# Altium project RFSOC_SAWG_Mezzanine.PrjPcb
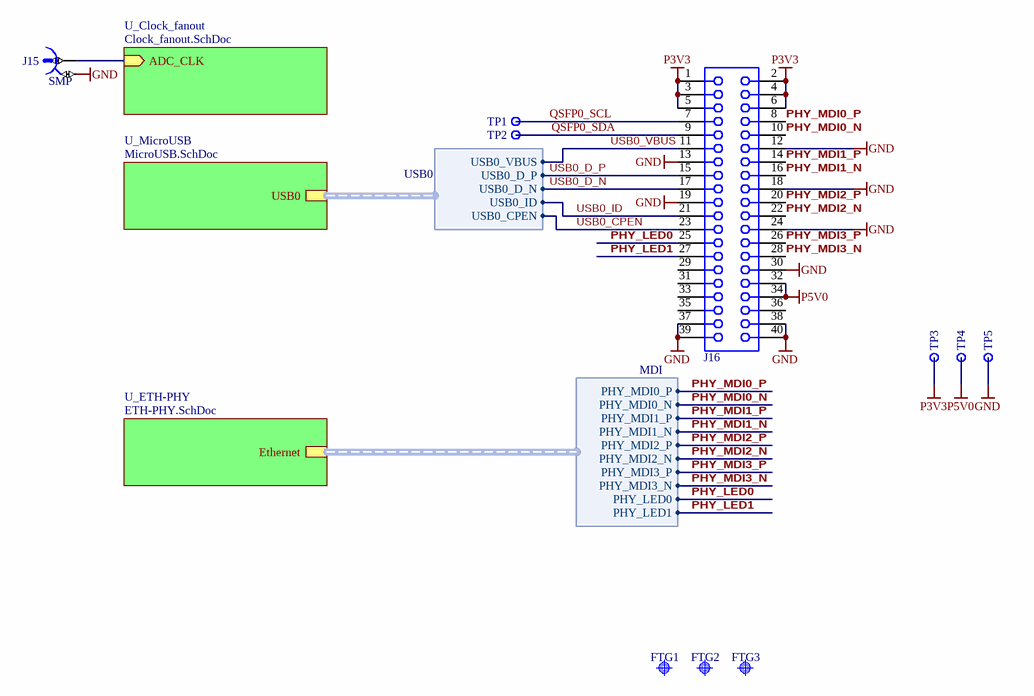
[diagram p0: RFSOC_SAWG_Mezzanine.SchDoc]
4 sheets, 92 parts. Net scope: hierarchical (ports join the sheet entries above them; power ports are global).
Board file: RFSOC_SAWG_Mezzanine.PcbDoc
Sheets:
  RFSOC_SAWG_Mezzanine.SchDoc
    U_Clock_fanout = Clock_fanout.SchDoc
    U_ETH-PHY = ETH-PHY.SchDoc
    U_MicroUSB = MicroUSB.SchDoc

## Sheet RFSOC_SAWG_Mezzanine.SchDoc: RFSOC SAWG
size 420 x 297 mm; Author: G.Kasprowicz; CompanyName: WUT ISE; DrawnBy: G.Kasprowicz; Organization: WUT ISE; Address1: PW ISE; Address2: Nowowiejska 15/19 00-665 Warsaw; Address3: gkasprow@gmail.com; Revision: 1; SheetNumber: 1; SheetTotal: 4; ModifiedBy: -; CheckedDate: -; Title2: Mezzanine; DivGrp: WUT ISE; Designer: G.Kasprowicz; ModifiedDate: -; ProjectName: Sensor Box

### Parts
FTG1  Use only in PCB  [FIDUCIAL_TOP_S100-200]  (value not drawn)
FTG2  Use only in PCB  [FIDUCIAL_TOP_S100-200]  (value not drawn)
FTG3  Use only in PCB  [FIDUCIAL_TOP_S100-200]  (value not drawn)
J15  SMP  [AMPHENOL_302102]
J16  658807713040  [658807713040]  (value not drawn)
TP1  Test Point  [TPS127]  (value not drawn)  (no BOM)
TP2  Test Point  [TPS127]  (value not drawn)  (no BOM)
TP3  Test Point  [TPS127]  (value not drawn)
TP4  Test Point  [TPS127]  (value not drawn)
TP5  Test Point  [TPS127]  (value not drawn)

### Sub-sheets
U_Clock_fanout = Clock_fanout.SchDoc: ADC_CLK (in)
U_ETH-PHY = ETH-PHY.SchDoc: Ethernet (harness MDI)
U_MicroUSB = MicroUSB.SchDoc: USB0 (harness USB0)

### Harnesses
USB0: USB0_VBUS, USB0_D_P, USB0_D_N, USB0_ID, USB0_CPEN
MDI: PHY_MDI0_N, PHY_MDI1_P, PHY_MDI1_N, PHY_MDI2_P, PHY_MDI2_N, PHY_MDI3_P, PHY_MDI3_N, PHY_LED0, PHY_LED1, PHY_MDI0_P

### Nets
GND: J15.2 J16.12 J16.13 J16.18 J16.19 J16.24 J16.30 J16.37 J16.38 J16.39 J16.40 TP5.1
P3V3: J16.1 J16.2 J16.3 J16.4 J16.5 J16.6 TP3.1
P5V0: J16.32 J16.34 TP4.1
PHY_LED0: J16.25 ; sheet U_ETH-PHY/Ethernet.PHY_LED0
PHY_LED1: J16.27 ; sheet U_ETH-PHY/Ethernet.PHY_LED1
PHY_MDI0_N: J16.10 ; sheet U_ETH-PHY/Ethernet.PHY_MDI0_N
PHY_MDI0_P: J16.8 ; sheet U_ETH-PHY/Ethernet.PHY_MDI0_P
PHY_MDI1_N: J16.16 ; sheet U_ETH-PHY/Ethernet.PHY_MDI1_N
PHY_MDI1_P: J16.14 ; sheet U_ETH-PHY/Ethernet.PHY_MDI1_P
PHY_MDI2_N: J16.22 ; sheet U_ETH-PHY/Ethernet.PHY_MDI2_N
PHY_MDI2_P: J16.20 ; sheet U_ETH-PHY/Ethernet.PHY_MDI2_P
PHY_MDI3_N: J16.28 ; sheet U_ETH-PHY/Ethernet.PHY_MDI3_N
PHY_MDI3_P: J16.26 ; sheet U_ETH-PHY/Ethernet.PHY_MDI3_P
QSFP0_SCL: J16.7 TP1.1
QSFP0_SDA: J16.9 TP2.1
USB0_CPEN: J16.23 ; sheet U_MicroUSB/USB0.USB0_CPEN
USB0_D_N: J16.17 ; sheet U_MicroUSB/USB0.USB0_D_N
USB0_D_P: J16.15 ; sheet U_MicroUSB/USB0.USB0_D_P
USB0_ID: J16.21 ; sheet U_MicroUSB/USB0.USB0_ID
USB0_VBUS: J16.11 ; sheet U_MicroUSB/USB0.USB0_VBUS
NetJ15_1: J15.1 ; sheet U_Clock_fanout/ADC_CLK

Not connected (* = marked no-connect by the designer): J16 29 31 33 35 36

### Notes on the sheet
- Project/Equipment
- Document
- Designer
- Drawn by
- Check.by
- Copyright WUT ISE 2020.
  This documentation describes Open Hardware and is licensed under the CERN OHL v.1.2. You may redistribute and modify this documentation under the terms of the CERN OHL v.1.2. (http://ohwr.org/CERNOHL). This documentation is distributed WITHOUT ANY EXPRESS OR IMPLIED WARRANTY, INCLUDING OF MERCHANTABILITY, SATISFACTORY QUALITY AND FITNESS FOR A PARTICULAR PURPOSE. Please see the CERN OHL v.1.2 for applicable conditions.
- Contact
- File
- Last Mod.
- Print Date
- Sheet
- Size
- A3
- of
- Rev

### Library data of the parts
FTG1-FTG3 = FIDUCIAL_TARGET_S100-200: Fiducial Target; Part Description: Square Fiducial Target, Top Layer, 1.0mm, Top Solder 2.0mm, Keepout =2.0mm; Mounted: No; Part Number: FIDUCIAL_TARGET_S100-200; Component Kind: Standard (No BOM); Component Type: Standard (No BOM); Pin Count: 1; Family: Fiducial; Socket: No; SMD: Yes; Sense: No; Status: None; ComponentHeight: 0mm; HelpURL: Undefined; Author: CERN DEM JLC; CreateDate: 09.02.2010; LatestRevisionDate: 04.04.2012; PackageDescription: Square Fiducial Target, Top Layer, 1.0mm, Top Solder 2.0mm, Keepout =2.0mm
J15 = AMPHENOL_302102: Part Description: 50 Ohm RF Connector, SMP End Launch Jack for 1.6mm PCB,  Flat Tab Contact; Manufacturer Part Number: 302102; PressFit: No; Part Number: AMPHENOL_302102; Component Kind: Standard; Component Type: Standard; Pin Count: 2; Family: SMP; Mounted: Yes; Socket: No; SMD: No; Sense: No; Status: None; Manufacturer: AMPHENOL; ComponentHeight: 5.09mm; HelpURL: \\cern.ch\dfs\Applications\Altium\Datasheets\AMPHENOL_302102.pdf; Author: CERN DEM MR; CreateDate: 28.11.2017; LatestRevisionDate: 19.12.2017
J16 = 658807713040: WR-BTB Board to Board Connector, Female Receptacle, pitch 0.8mm, height 7.75mm, 40p; Manufacturer: Wurth Elektronik; Compliance: Lead free / RoHS; Contact Resistance: 50mΩ; Insulation Resistance: 100MΩ; Rated Current: 0.5A; Working Voltage: 50VAC; Withstanding Voltage: 500VAC; ComponentLink1Description: Website Link; ComponentLink1URL: https://www.we-online.com/redexpert/article/658807713040?ad; ComponentLink2Description: Datasheet Link; ComponentLink2URL: https://www.we-online.com/redexpert/spec/658807713040?ad; Manufacturer Part Number: 658807713040; Category: Board-to-Board Connectors; Match Code: WR-BTB; Mount: Surface Mount; Operating Temperature Max: 85°C; Operating Temperature Min: -55°C; Packaging: Tape and Reel; Height: 7.75mm; Gender: Female Receptacle; Number of Pins: 40; Orientation: Vertical; Pitch: 0.8mm
TP1-TP5 = SMD_PAD_1.27X1.27MM: Part Description: 1.27mm x 1.27mm PCB Copper Area (SMD Test Point); Mounted: No; Part Number: SMD_PAD_1.27X1.27MM; Component Type: Standard (No BOM); Pin Count: 1; Family: Test Point; Socket: No; SMD: No; Sense: No; Status: None; ComponentHeight: 0mm; HelpURL: Undefined; Author: CERN DEM JLC; CreateDate: 12.01.2008; LatestRevisionDate: 12.01.2008; PackageDescription: 1.27mm x 1.27mm PCB Copper Area (SMD Test Point)
  TP3-TP5: Component Kind: Standard (No BOM)

## Sheet Clock_fanout.SchDoc: RFSOC SAWG
size 420 x 297 mm; Author: G.Kasprowicz; CompanyName: WUT ISE; DrawnBy: G.Kasprowicz; Organization: WUT ISE; Address1: PW ISE; Address2: Nowowiejska 15/19 00-665 Warsaw; Address3: gkasprow@gmail.com; Revision: 1; SheetNumber: 4; SheetTotal: 4; ModifiedBy: -; CheckedDate: -; Title2: Clock fanout; DivGrp: WUT ISE; Designer: G.Kasprowicz; ModifiedDate: -; ProjectName: Sensor Box
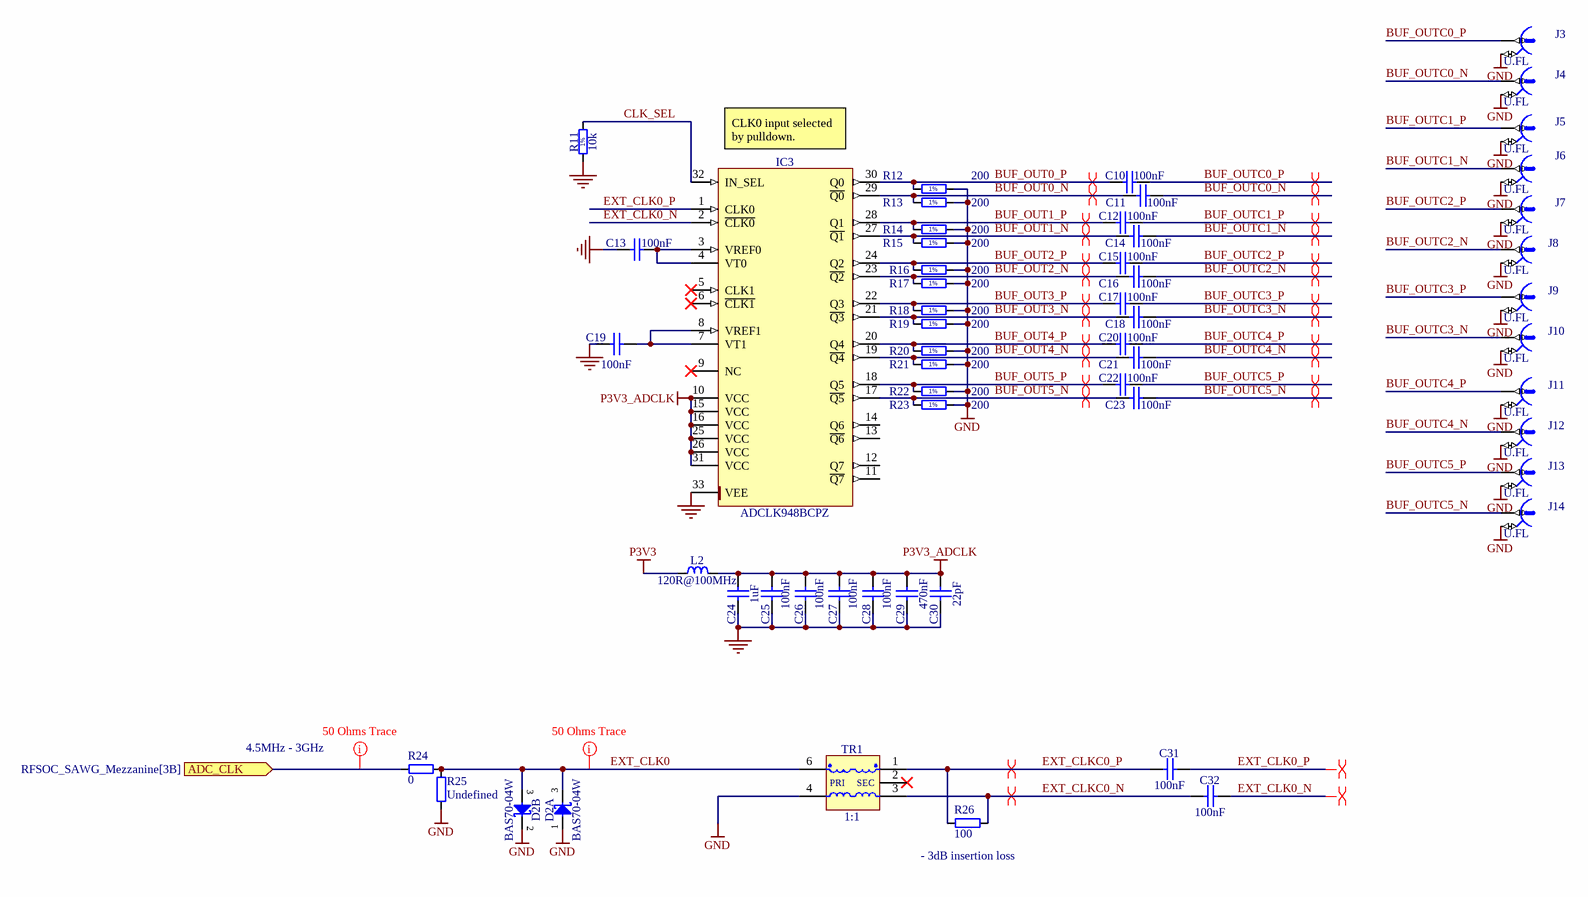
[diagram p1: Clock_fanout.SchDoc]

### Parts
C10  100nF  [CAPC0603X33N]
C11  100nF  [CAPC0603X33N]
C12  100nF  [CAPC0603X33N]
C13  100nF  [CAPC0603X33N]
C14  100nF  [CAPC0603X33N]
C15  100nF  [CAPC0603X33N]
C16  100nF  [CAPC0603X33N]
C17  100nF  [CAPC0603X33N]
C18  100nF  [CAPC0603X33N]
C19  100nF  [CAPC0603X33N]
C20  100nF  [CAPC0603X33N]
C21  100nF  [CAPC0603X33N]
C22  100nF  [CAPC0603X33N]
C23  100nF  [CAPC0603X33N]
C24  1uF  [CAPC1005X55N]
C25  100nF  [CAPC0603X33N]
C26  100nF  [CAPC0603X33N]
C27  100nF  [CAPC0603X33N]
C28  100nF  [CAPC0603X33N]
C29  470nF  [CAPC0603X33N]
C30  22pF  [CAPC1005X55N]
C31  100nF  [CAPC0603X33N]
C32  100nF  [CAPC0603X33N]
D2  BAS70-04W  [SOT65P210X110-3N]  (parts A,B of 2)
IC3  ADCLK948BCPZ  [QFN50P500X500X80-33N-S285]
J3  U.FL  [HIROSE_U.FL-R-SMT-1(10)]
J4  U.FL  [HIROSE_U.FL-R-SMT-1(10)]
J5  U.FL  [HIROSE_U.FL-R-SMT-1(10)]
J6  U.FL  [HIROSE_U.FL-R-SMT-1(10)]
J7  U.FL  [HIROSE_U.FL-R-SMT-1(10)]
J8  U.FL  [HIROSE_U.FL-R-SMT-1(10)]
J9  U.FL  [HIROSE_U.FL-R-SMT-1(10)]
J10  U.FL  [HIROSE_U.FL-R-SMT-1(10)]
J11  U.FL  [HIROSE_U.FL-R-SMT-1(10)]
J12  U.FL  [HIROSE_U.FL-R-SMT-1(10)]
J13  U.FL  [HIROSE_U.FL-R-SMT-1(10)]
J14  U.FL  [HIROSE_U.FL-R-SMT-1(10)]
L2  120R@100MHz  [INDC1608X65N]
R11  10k  [RESC1005X40N]
R12  200  [RESC1005X40N]
R13  200  [RESC1005X40N]
R14  200  [RESC1005X40N]
R15  200  [RESC1005X40N]
R16  200  [RESC1005X40N]
R17  200  [RESC1005X40N]
R18  200  [RESC1005X40N]
R19  200  [RESC1005X40N]
R20  200  [RESC1005X40N]
R21  200  [RESC1005X40N]
R22  200  [RESC1005X40N]
R23  200  [RESC1005X40N]
R24  0  [RESC1005X40N]
R25  Undefined  [RESC1005X40N]
R26  100  [RESC1005X35N]
TR1  1:1  [XFMR_MINI-CIRCUITS_AT224]

### Ports
ADC_CLK (in, see RFSOC_SAWG_Mezzanine[3B])

### Nets
GND: C13.1 C19.1 C24.1 C25.1 C26.1 C27.1 C28.1 C29.1 C30.1 D2.1(A) D2.2(C) IC3.33(VEE) J3.2 J4.2 J5.2 J6.2 J7.2 J8.2 J9.2 J10.2 J11.2 J12.2 J13.2 J14.2 R11.1 R12.2 R13.2 R14.2 R15.2 R16.2 R17.2 R18.2 R19.2 R20.2 R21.2 R22.2 R23.2 R25.2 TR1.4(P)
P3V3: L2.2
P3V3_ADCLK: C24.2 C25.2 C26.2 C27.2 C28.2 C29.2 C30.2 IC3.10(VCC) IC3.15(VCC) IC3.16(VCC) IC3.25(VCC) IC3.26(VCC) IC3.31(VCC) L2.1
BUF_OUT0_N: C11.1 IC3.29(~{Q0}) R13.1
BUF_OUT0_P: C10.1 IC3.30(Q0) R12.1
BUF_OUT1_N: C14.1 IC3.27(~{Q1}) R15.1
BUF_OUT1_P: C12.1 IC3.28(Q1) R14.1
BUF_OUT2_N: C16.1 IC3.23(~{Q2}) R17.1
BUF_OUT2_P: C15.1 IC3.24(Q2) R16.1
BUF_OUT3_N: C18.1 IC3.21(~{Q3}) R19.1
BUF_OUT3_P: C17.1 IC3.22(Q3) R18.1
BUF_OUT4_N: C21.1 IC3.19(~{Q4}) R21.1
BUF_OUT4_P: C20.1 IC3.20(Q4) R20.1
BUF_OUT5_N: C23.1 IC3.17(~{Q5}) R23.1
BUF_OUT5_P: C22.1 IC3.18(Q5) R22.1
BUF_OUTC0_N: C11.2 J4.1
BUF_OUTC0_P: C10.2 J3.1
BUF_OUTC1_N: C14.2 J6.1
BUF_OUTC1_P: C12.2 J5.1
BUF_OUTC2_N: C16.2 J8.1
BUF_OUTC2_P: C15.2 J7.1
BUF_OUTC3_N: C18.2 J10.1
BUF_OUTC3_P: C17.2 J9.1
BUF_OUTC4_N: C21.2 J12.1
BUF_OUTC4_P: C20.2 J11.1
BUF_OUTC5_N: C23.2 J14.1
BUF_OUTC5_P: C22.2 J13.1
CLK_SEL: IC3.32(IN_SEL) R11.2
EXT_CLK0: D2.3(COMAC) R24.2 R25.1 TR1.6(PDOT)
EXT_CLK0_N: C32.2 IC3.2(~{CLK0})
EXT_CLK0_P: C31.2 IC3.1(CLK0)
EXT_CLKC0_N: C32.1 R26.2 TR1.3(S)
EXT_CLKC0_P: C31.1 R26.1 TR1.1(SDOT)
NetC13_2: C13.2 IC3.3(VREF0) IC3.4(VT0)
NetC19_2: C19.2 IC3.7(VT1) IC3.8(VREF1)
NetJ15_1: R24.1 ; port ADC_CLK

Not connected (* = marked no-connect by the designer): IC3 5(CLK1)* 6(~{CLK1})* 9(NC)* 11(~{Q7}) 12(Q7) 13(~{Q6}) 14(Q6); TR1 2(NC)*

### Layout directives
differential pair; differential pair class LVPECL: BUF_OUT0_N, BUF_OUT0_P, BUF_OUT1_N, BUF_OUT1_P, BUF_OUT2_N, BUF_OUT2_P, BUF_OUT3_N, BUF_OUT3_P, BUF_OUT4_N, BUF_OUT4_P, BUF_OUT5_N, BUF_OUT5_P, BUF_OUTC0_N, BUF_OUTC0_P, BUF_OUTC1_N, BUF_OUTC1_P, BUF_OUTC2_N, BUF_OUTC2_P, BUF_OUTC3_N, BUF_OUTC3_P, BUF_OUTC4_N, BUF_OUTC4_P, BUF_OUTC5_N, BUF_OUTC5_P
net class 50 Ohms Trace: EXT_CLK0, NetJ15_1
differential pair; differential pair class Diff_100Ohm: EXT_CLK0_N, EXT_CLK0_P, EXT_CLKC0_N, EXT_CLKC0_P

### Notes on the sheet
- (near IC3) CLK0 input selected by pulldown.
- 4.5MHz - 3GHz
- (near R26) - 3dB insertion loss
- Project/Equipment
- Document
- Designer
- Drawn by
- Check.by
- Copyright WUT ISE 2020.
  This documentation describes Open Hardware and is licensed under the CERN OHL v.1.2. You may redistribute and modify this documentation under the terms of the CERN OHL v.1.2. (http://ohwr.org/CERNOHL). This documentation is distributed WITHOUT ANY EXPRESS OR IMPLIED WARRANTY, INCLUDING OF MERCHANTABILITY, SATISFACTORY QUALITY AND FITNESS FOR A PARTICULAR PURPOSE. Please see the CERN OHL v.1.2 for applicable conditions.
- Contact
- File
- Last Mod.
- Print Date
- Sheet
- Size
- A3
- of
- Rev
- (in symbol R0402_10K_1%_0.0625W_100PPM) 1%
- (in symbol R0402_200R_1%_0.0625W_100PPM) 1%
- (in symbol XFMR_MINI-CIRCUITS_TC1-1-13M+) PRI; SEC

### Library data of the parts
C10-C23 C25-C28 C31 C32 = CC0201_100NF_6.3V_10%_X5R: Non-polarised capacitor; Part Description: SMD Multilayer Chip Ceramic Capacitor; Manufacturer: GENERIC; Manufacturer1 Part Number: 02016D104KAT2A; Voltage: 6.3V; TC: X5R; Tolerance: ±10%; Part Number: CC0201_100NF_6.3V_10%_X5R; Component Kind: Standard; Component Type: Standard; Pin Count: 2; Value: 100nF; Status: Not Recommended; Manufacturer Part Number: CC0201_100NF_6.3V_10%_X5R; Case: 0201; Mounted: Yes; Socket: No; SMD: Yes; Sense: No; Manufacturer1 Example: AVX; Manufacturer1 ComponentHeight: 0.33mm; HelpURL: \\cern.ch\dfs\Applications\Altium\Datasheets\CC0201_X5R_AVX.pdf; Author: CERN DEM JLC
  C10-C23 C25-C28: CreateDate: 2007-12-03; LatestRevisionDate: 2007-12-03
  C31 C32: CreateDate: 03.12.2007; LatestRevisionDate: 03.12.2007
C24 = CC0402_1UF_16V_10%_X5R: Non-polarised capacitor; Part Description: SMD Multilayer Chip Ceramic Capacitor; Manufacturer: GENERIC; Manufacturer1 Part Number: C1005X5R1C105KT; Voltage: 16V; TC: X5R; Tolerance: ±10%; Part Number: CC0402_1UF_16V_10%_X5R; Component Kind: Standard; Component Type: Standard; Pin Count: 2; Value: 1uF; Status: Preferred; Manufacturer Part Number: CC0402_1UF_16V_10%_X5R; Case: 0402; Mounted: Yes; Socket: No; SMD: Yes; Sense: No; Manufacturer1 Example: TDK; Manufacturer1 ComponentHeight: 0.55mm; HelpURL: \\cern.ch\dfs\Applications\Altium\Datasheets\CC0402_X5R_TDK_C.pdf; Author: CERN DEM JLC; CreateDate: 2012-10-25; LatestRevisionDate: 2012-10-25
C29 = CC0201_470NF_4V_20%_X5R: Non-polarised capacitor; Part Description: SMD Multilayer Chip Ceramic Capacitor; Manufacturer: GENERIC; Manufacturer1 Part Number: AMK063BJ474MP-F; Voltage: 4V; TC: X5R; Tolerance: ±20%; Part Number: CC0201_470NF_4V_20%_X5R; Component Kind: Standard; Component Type: Standard; Pin Count: 2; Value: 470nF; Status: Not Recommended; Manufacturer Part Number: CC0201_470NF_4V_20%_X5R; Case: 0201; Mounted: Yes; Socket: No; SMD: Yes; Sense: No; Manufacturer1 Example: TAIYO YUDEN; Manufacturer1 ComponentHeight: 0.33mm; HelpURL: \\cern.ch\dfs\Applications\Altium\Datasheets\CC0201_X5R_TAIYO-YUDEN_STANDARD-CLASS2.pdf; Author: CERN DEM JLC; CreateDate: 27.05.2010; LatestRevisionDate: 27.05.2010
C30 = CC0402_22PF_50V_5%_C0G: Non-polarised capacitor; Part Description: SMD Multilayer Chip Ceramic Capacitor; Manufacturer: GENERIC; Manufacturer1 Part Number: C0402C220J5GACTU; Voltage: 50V; TC: C0G/NP0; Tolerance: ±5%; Part Number: CC0402_22PF_50V_5%_C0G; Component Kind: Standard; Component Type: Standard; Pin Count: 2; Value: 22pF; Status: Preferred; Manufacturer Part Number: CC0402_22PF_50V_5%_C0G; Case: 0402; Mounted: Yes; Socket: No; SMD: Yes; Sense: No; Manufacturer1 Example: KEMET; Manufacturer1 ComponentHeight: 0.55mm; HelpURL: \\cern.ch\dfs\Applications\Altium\Datasheets\CC0805_C0G_KEMET_(Commercial Grade).pdf; Author: CERN DEM JLC; CreateDate: 2007-12-03; LatestRevisionDate: 2007-12-03
D2 = BAS70-04W: Serial Schottky Diode; Part Description: Dual Series General-Purpose Schottky Diodes; Manufacturer: NXP SEMICONDUCTORS; Voltage: 70V; Power: 70mA; PressFit: No; Bonding: No; Part Number: BAS70-04W; Component Kind: Standard; Component Type: Standard; Device: BAS70-04W; PackageDescription: SOT323, 0.65mm Pitch; 3 Pin, 1.25mm W X 2.00mm L X 1.10mm H body, IPC Medium Density; Manufacturer Part Number: BAS70-04W; Pin Count: 3; Case: SOT323; Mounted: Yes; Socket: No; SMD: Yes; Sense: No; ComponentHeight: 1.10mm; HelpURL: \\cern.ch\dfs\Applications\Altium\Datasheets\BAS70-04W.pdf; Author: CERN DEM JLC; CreateDate: 05.12.2013; LatestRevisionDate: 05.12.2013
IC3 = ADCLK948BCPZ: Two Selectable Inputs, 8 LVPECL Outputs, SiGe Clock Fanout Buffer; Manufacturer: ANALOG DEVICES; PressFit: No; Bonding: No; Part Number: ADCLK948BCPZ; Component Kind: Standard; Component Type: Standard; Device: ADCLK948BCPZ; PackageDescription: QFN, 0.50mm Pitch, Square; 8 Pin X 8 Pin, 5mm X 5mm X 1.00mm H body (w/thermal tab 2.85 X 2.85mm),  IPC Medium Density; Part Description: Two Selectable Inputs, 8 LVPECL Outputs, SiGe Clock Fanout Buffer; Manufacturer Part Number: ADCLK948BCPZ; Pin Count: 33; Case: QFN32; Mounted: Yes; Socket: No; SMD: Yes; Sense: No; ComponentHeight: 0.8mm; Author: CERN DEM MR; HelpURL: \\cern.ch\dfs\Applications\Altium\Datasheets\ADCLK948BCPZ.pdf; CreateDate: 2016-11-30; LatestRevisionDate: 2016-11-30
J3-J14 = HIROSE_U.FL-R-SMT-1(10): Part Description: Up to 6GHz Ultra Small Surface Mount Male Coaxial Connectors U.FL Series; Manufacturer: HIROSE (HRS); PressFit: No; Part Number: HIROSE_U.FL-R-SMT-1(10); Component Kind: Standard; Component Type: Standard; Pin Count: 2; Family: U.FL; Mounted: Yes; Socket: No; SMD: Yes; Sense: No; Status: None; Manufacturer Part Number: U.FL-R-SMT-1(10); ComponentHeight: 1.25mm; HelpURL: \\cern.ch\dfs\Applications\Altium\Datasheets\HIROSE_U.FL-R-SMT-1(10).pdf; Author: CERN DEM JLC; CreateDate: 24.03.2010; LatestRevisionDate: 24.03.2010
L2 = IND0603_MURATA_BLM18SG121TN1D: Inductor; Part Description: SMD EMIFIL Suppression Chip Ferrite Bead; Manufacturer: MURATA; Power: 3A; Resistance: 0.025R; Tolerance: ±25%; Part Number: IND0603_MURATA_BLM18SG121TN1D; Component Kind: Standard; Component Type: Standard; Pin Count: 2; Value: 120R@100MHz; Status: None; Manufacturer Part Number: BLM18SG121TN1D; Case: 0603; Mounted: Yes; Socket: No; SMD: Yes; Sense: No; ComponentHeight: 0.65mm; HelpURL: \\cern.ch\dfs\Applications\Altium\Datasheets\IND0603_MURATA_BLM18S.pdf; Author: CERN DEM JLC; CreateDate: 23.07.2014; LatestRevisionDate: 23.07.2014
R11 = R0402_10K_1%_0.0625W_100PPM: Resistor - 1%; Part Description: General Purpose Thick Film Chip Resistor; Manufacturer: GENERIC; Manufacturer1 Part Number: 232270671003L; TC: ±100ppm/°C; PressFit: No; Part Number: R0402_10K_1%_0.0625W_100PPM; Component Kind: Standard; Component Type: Standard; Pin Count: 2; Value: 10k; Status: Not Recommended; Power: 0.0625W; Tolerance: ±1%; Manufacturer Part Number: R0402_10K_1%_0.0625W_100PPM; Case: 0402; Mounted: Yes; Sense: No; Socket: No; SMD: Yes; Manufacturer1 Example: YAGEO PHYCOMP; Manufacturer1 ComponentHeight: 0.4mm; HelpURL: \\cern.ch\dfs\Applications\Altium\Datasheets\R0402_Phycomp_RC0402.pdf; Author: CERN DEM JLC; CreateDate: 03.12.2007; LatestRevisionDate: 17.10.2012
R12-R23 = R0402_200R_1%_0.0625W_100PPM: Resistor - 1%; Part Description: General Purpose Thick Film Chip Resistor; Manufacturer: GENERIC; Manufacturer1 Part Number: 232270672001L; TC: ±100ppm/°C; PressFit: No; Part Number: R0402_200R_1%_0.0625W_100PPM; Component Kind: Standard; Component Type: Standard; Pin Count: 2; Value: 200; Status: Not Recommended; Power: 0.0625W; Tolerance: ±1%; Manufacturer Part Number: R0402_200R_1%_0.0625W_100PPM; Case: 0402; Mounted: Yes; Sense: No; Socket: No; SMD: Yes; Manufacturer1 Example: YAGEO PHYCOMP; Manufacturer1 ComponentHeight: 0.4mm; HelpURL: \\cern.ch\dfs\Applications\Altium\Datasheets\R0402_Phycomp_RC0402.pdf; Author: CERN DEM JLC; CreateDate: 03.12.2007; LatestRevisionDate: 17.10.2012
R24 = R0402_0R_JUMPER: Resistor; Part Description: 1A (0.05R Max DC Resistance) Zero Ohm Jumper; Manufacturer: GENERIC; Manufacturer1 Part Number: 232270591001L; PressFit: No; Case: 0402; Value: 0; Part Number: R0402_0R_JUMPER; Component Kind: Standard; Component Type: Standard; Pin Count: 2; Status: Not Recommended; Manufacturer Part Number: R0402_0R_JUMPER; Mounted: Yes; Sense: No; Socket: No; SMD: Yes; Manufacturer1 Example: YAGEO PHYCOMP; Manufacturer1 ComponentHeight: 0.4mm; HelpURL: \\cern.ch\dfs\Applications\Altium\Datasheets\R0402_Phycomp_RC0402.pdf; Author: CERN DEM JLC; CreateDate: 03.12.2007; LatestRevisionDate: 17.10.2012
R25 = R0402_NO-VALUE: Resistor; Part Description: Reserved Footprint For a 0402 (1005) Chip Resistor; PressFit: No; Mounted: No; Case: 0402; Value: Undefined; Part Number: R0402_NO-VALUE; Component Kind: Standard; Component Type: Standard; Pin Count: 2; Status: None; Manufacturer: Undefined; Manufacturer Part Number: R0402_NO-VALUE; Sense: No; Socket: No; SMD: Yes; Manufacturer1 Example: Undefined; Manufacturer1 Part Number: Undefined; Manufacturer1 ComponentHeight: Undefined; HelpURL: Undefined; Author: CERN DEM JLC; CreateDate: 03.12.2007; LatestRevisionDate: 13.03.2008
R26 = R0402_100R_0.1%_0.063W_25PPM: Resistor - 0.1%; Part Description: Thin Film Precision Resistor; Manufacturer: GENERIC; Manufacturer1 Part Number: CPF0402B100RE1; Power: 0.063W; TC: ±25ppm/°C; PressFit: No; Case: 0402; Value: 100; Tolerance: ±0.1%; Part Number: R0402_100R_0.1%_0.063W_25PPM; Component Kind: Standard; Component Type: Standard; Pin Count: 2; Status: Not Recommended; Manufacturer Part Number: R0402_100R_0.1%_0.063W_25PPM; Mounted: Yes; Sense: No; Socket: No; SMD: Yes; Manufacturer1 Example: TE CONNECTIVITY; Manufacturer1 ComponentHeight: 0.35mm; HelpURL: \\cern.ch\dfs\Applications\Altium\Datasheets\R0402_TYCO_CPF.pdf; Author: CERN DEM JMW; CreateDate: 22.09.2015; LatestRevisionDate: 22.09.2015
TR1 = XFMR_MINI-CIRCUITS_TC1-1-13M+: 50 Ohms 4.5 To 3000MHz RF Transformers; Part Number: XFMR_MINI-CIRCUITS_TC1-1-13M+; Component Kind: Standard; Component Type: Standard; Pin Count: 5; Value: 1:1; Status: None; Part Description: 50 Ohms 4.5 to 3000MHz RF Transformer; Manufacturer: MINI-CIRCUITS; Manufacturer Part Number: TC1-1-13M+; Mounted: Yes; Socket: No; Sense: No; SMD: Yes; ComponentHeight: 3.81mm; HelpURL: \\cern.ch\dfs\Applications\Altium\Datasheets\XFMR_MINI-CIRCUITS_TC1-1-13M+.pdf; Author: CERN DEM JLC; CreateDate: 30.11.2011; LatestRevisionDate: 30.11.2011

## Sheet ETH-PHY.SchDoc: RFSOC SAWG
size 420 x 297 mm; Author: G.Kasprowicz; CompanyName: WUT ISE; DrawnBy: G.Kasprowicz; Organization: WUT ISE; Address1: PW ISE; Address2: Nowowiejska 15/19 00-665 Warsaw; Address3: gkasprow@gmail.com; Revision: 1; SheetNumber: 2; SheetTotal: 4; ModifiedBy: -; CheckedDate: -; Title2: ETH-PHY; DivGrp: WUT ISE; Designer: G.Kasprowicz; ModifiedDate: -; ProjectName: Sensor Box
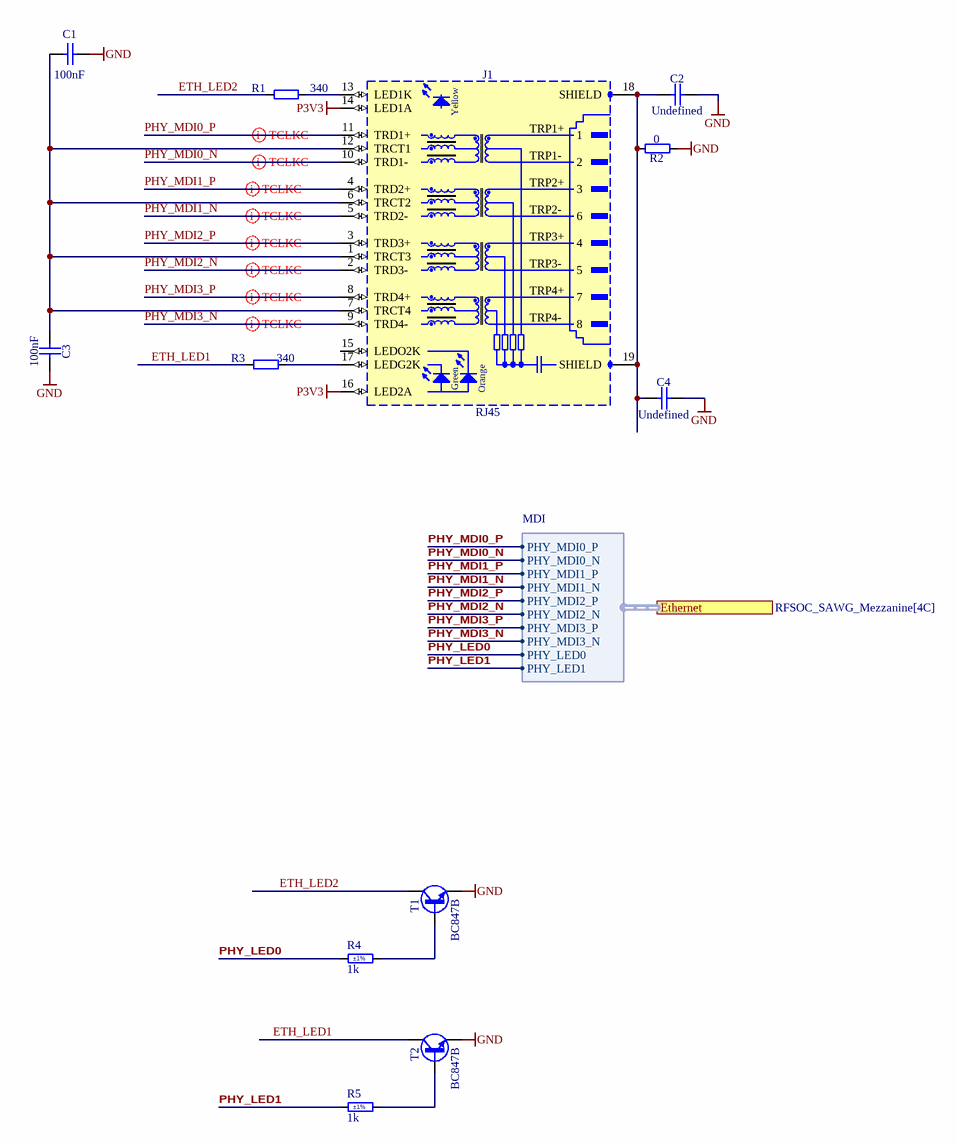
[diagram p2: ETH-PHY.SchDoc]

### Parts
C1  100nF  [CAPC1005X55N]
C2  Undefined  [CAPC1608X90N]
C3  100nF  [CAPC1005X55N]
C4  Undefined  [CAPC1608X90N]
J1  RJ45  [BEL_L829-1J1T-43]
R1  340  [RESC1608X55N]
R2  0  [RESC1005X40N]
R3  340  [RESC1608X55N]
R4  1k  Tolerance: ±1%  [RESC1005X40N]
R5  1k  Tolerance: ±1%  [RESC1005X40N]
T1  BC847B  [SOT95P230X110-3N]
T2  BC847B  [SOT95P230X110-3N]

### Ports
Ethernet (harness MDI, see RFSOC_SAWG_Mezzanine[4C])

### Harnesses
MDI: PHY_MDI0_N, PHY_MDI1_P, PHY_MDI1_N, PHY_MDI2_P, PHY_MDI2_N, PHY_MDI3_P, PHY_MDI3_N, PHY_LED0, PHY_LED1, PHY_MDI0_P

### Nets
GND: C1.2 C2.2 C3.1 C4.2 R2.1 T1.2(E) T2.2(E)
P3V3: J1.14(LED1A) J1.16(LED2A)
ETH_LED1: R3.1 T2.3(C)
ETH_LED2: R1.1 T1.3(C)
PHY_LED0: R4.1 ; port Ethernet.PHY_LED0
PHY_LED1: R5.1 ; port Ethernet.PHY_LED1
PHY_MDI0_N: J1.10(TRD1-) ; port Ethernet.PHY_MDI0_N
PHY_MDI0_P: J1.11(TRD1+) ; port Ethernet.PHY_MDI0_P
PHY_MDI1_N: J1.5(TRD2-) ; port Ethernet.PHY_MDI1_N
PHY_MDI1_P: J1.4(TRD2+) ; port Ethernet.PHY_MDI1_P
PHY_MDI2_N: J1.2(TRD3-) ; port Ethernet.PHY_MDI2_N
PHY_MDI2_P: J1.3(TRD3+) ; port Ethernet.PHY_MDI2_P
PHY_MDI3_N: J1.9(TRD4-) ; port Ethernet.PHY_MDI3_N
PHY_MDI3_P: J1.8(TRD4+) ; port Ethernet.PHY_MDI3_P
NetC1_1: C1.1 C3.2 J1.1(TRCT3) J1.6(TRCT2) J1.7(TRCT4) J1.12(TRCT1)
NetC2_1: C2.1 C4.1 J1.18(SHIELD) J1.19(SHIELD) R2.2
NetJ1_13: J1.13(LED1K) R1.2
NetJ1_17: J1.17(LEDG2K) R3.2
NetR4_2: R4.2 T1.1(B)
NetR5_2: R5.2 T2.1(B)

Not connected (* = marked no-connect by the designer): J1 15(LEDO2K)

### Layout directives
differential pair: PHY_MDI0_N, PHY_MDI0_P, PHY_MDI1_N, PHY_MDI1_P, PHY_MDI2_N, PHY_MDI2_P, PHY_MDI3_N, PHY_MDI3_P

### Notes on the sheet
- Project/Equipment
- Document
- Designer
- Drawn by
- Check.by
- Copyright WUT ISE 2020.
  This documentation describes Open Hardware and is licensed under the CERN OHL v.1.2. You may redistribute and modify this documentation under the terms of the CERN OHL v.1.2. (http://ohwr.org/CERNOHL). This documentation is distributed WITHOUT ANY EXPRESS OR IMPLIED WARRANTY, INCLUDING OF MERCHANTABILITY, SATISFACTORY QUALITY AND FITNESS FOR A PARTICULAR PURPOSE. Please see the CERN OHL v.1.2 for applicable conditions.
- Contact
- File
- Last Mod.
- Print Date
- Sheet
- Size
- A3
- of
- Rev
- (in symbol BELFUSE_L829-1J1T-43) Yellow; TRP1+; TRP1-; TRP2+; TRP2-; TRP3+; TRP3-; TRP4+; TRP4-; Green; Orange

### Library data of the parts
C1 C3 = CC0402_100NF_16V_10%_X5R: Non-polarised capacitor; Part Description: SMD Multilayer Chip Ceramic Capacitor; Manufacturer: GENERIC; Manufacturer1 Part Number: GRM155R61C104KA88D; Voltage: 16V; TC: X5R; Tolerance: ±10%; Value: 100nF; Part Number: CC0402_100NF_16V_10%_X5R; Component Kind: Standard; Component Type: Standard; Pin Count: 2; Status: None; Manufacturer Part Number: CC0402_100NF_16V_10%_X5R; Case: 0402; Mounted: Yes; Socket: No; SMD: Yes; Sense: No; Manufacturer1 Example: MURATA; Manufacturer1 ComponentHeight: 0.55mm; HelpURL: \\cern.ch\dfs\Applications\Altium\Datasheets\CC0402_X5R_MURATA_GRM.pdf; Author: CERN DEM JLC
  C1: CreateDate: 10/12/2013; LatestRevisionDate: 10/12/2013
  C3: CreateDate: 10.12.2013; LatestRevisionDate: 10.12.2013
C2 C4 = CC0603_NO-VALUE: Non-polarised capacitor; Part Description: Reserved Footprint For 0603(1608) Chip Ceramic Capacitor; Mounted: No; Part Number: CC0603_NO-VALUE; Component Kind: Standard; Component Type: Standard; Pin Count: 2; Value: Undefined; Status: None; Manufacturer: Undefined; Manufacturer Part Number: CC0603_NO-VALUE; Case: 0603; Socket: No; SMD: Yes; Sense: No; Manufacturer1 ComponentHeight: 0.9mm; HelpURL: Undefined; Author: CERN DEM MR; CreateDate: 22.11.2016; LatestRevisionDate: 22.11.2016
J1 = BELFUSE_L829-1J1T-43: 1 Port, RJ45, Gigabit Ethernet, MagJack Connector Module With Yellow And Green/Orange LEDs; Part Description: 1 Port, Yellow/ Green-Orange LEDs,  RJ45 10/100/1000 Gigabit Ethernet, MagJack® Connector Module; Manufacturer: BEL MAGNETIC SOLUTIONS; PressFit: No; Part Number: BELFUSE_L829-1J1T-43; Component Kind: Standard; Component Type: Standard; Pin Count: 19; Family: RJ45; Mounted: Yes; Socket: No; SMD: No; Sense: No; Status: None; Manufacturer Part Number: L829-1J1T-43; ComponentHeight: 13.3mm; HelpURL: \\cern.ch\dfs\Applications\Altium\Datasheets\BEL_L829-1J1T-43.pdf; Author: CERN DEM JLC; CreateDate: 22.08.2011; LatestRevisionDate: 20.09.2018
R1 R3 = R0603_340R_0.1%_0.063W_10PPM: Resistor - 0.1%; Part Description: Thin Film Chip Resistor; Manufacturer: GENERIC; Manufacturer1 Part Number: RN73C1J340RBTDF; Power: 0.063W; TC: ±10ppm; PressFit: No; Part Number: R0603_340R_0.1%_0.063W_10PPM; Component Kind: Standard; Component Type: Standard; Pin Count: 2; Value: 340; Status: Not Recommended; Tolerance: ±0.1%; Manufacturer Part Number: R0603_340R_0.1%_0.063W_10PPM; Case: 0603; Mounted: Yes; Sense: No; Socket: No; SMD: Yes; Manufacturer1 Example: TYCO HOLSWORTHY; Manufacturer1 ComponentHeight: 0.5mm; HelpURL: \\cern.ch\dfs\Applications\Altium\Datasheets\R0603_Tyco_RN73.pdf; Author: CERN DEM JLC; CreateDate: 03.12.2007; LatestRevisionDate: 13.03.2008
R2 = R0402_0R_JUMPER: as R24 on sheet Clock_fanout; Part Number: R0402_0R_JUMPER; Component Kind: Standard; Component Type: Standard; Pin Count: 2; Value: 0; Status: Not Recommended; Manufacturer Part Number: R0402_0R_JUMPER; Case: 0402; Mounted: Yes; Sense: No; Socket: No; SMD: Yes; Manufacturer1 Example: YAGEO PHYCOMP; Manufacturer1 ComponentHeight: 0.4mm; HelpURL: \\cern.ch\dfs\Applications\Altium\Datasheets\R0402_Phycomp_RC0402.pdf; Author: CERN DEM JLC; CreateDate: 03/12/2007; LatestRevisionDate: 17/10/2012
R4 R5 = R0402_1K_1%_0.0625W_100PPM: Resistor - 1%; Part Description: General Purpose Thick Film Chip Resistor; Manufacturer: GENERIC; Manufacturer1 Part Number: 232270671002L; TC: ±100ppm/°C; PressFit: No; Case: 0402; Value: 1k; Part Number: R0402_1K_1%_0.0625W_100PPM; Component Kind: Standard; Component Type: Standard; Pin Count: 2; Status: Not Recommended; Power: 0.0625W; Manufacturer Part Number: R0402_1K_1%_0.0625W_100PPM; Mounted: Yes; Sense: No; Socket: No; SMD: Yes; Manufacturer1 Example: YAGEO PHYCOMP; Manufacturer1 ComponentHeight: 0.4mm; HelpURL: \\cern.ch\dfs\Applications\Altium\Datasheets\R0402_Phycomp_RC0402.pdf; Author: CERN DEM JLC; CreateDate: 03.12.2007; LatestRevisionDate: 17.10.2012
T1 T2 = BC847B: NPN Transistor; Part Description: 45V 100mA NPN General-Purpose Transistor; Manufacturer: NXP SEMICONDUCTORS; PressFit: No; Bonding: No; Part Number: BC847B; Component Kind: Standard; Component Type: Standard; Device: BC847B; PackageDescription: SOT23, 0.95mm Pitch; 3 Pin, 1.30mm W X 2.90mm L X 1.10mm H body, IPC Medium Density; Manufacturer Part Number: BC847B; Pin Count: 3; Case: SOT23-3; Mounted: Yes; Socket: No; SMD: Yes; Sense: No; ComponentHeight: 1.1mm; HelpURL: \\cern.ch\dfs\Applications\Altium\Datasheets\BC847B.pdf; Author: CERN DEM JLC; CreateDate: 14.06.2011; LatestRevisionDate: 14.06.2011

## Sheet MicroUSB.SchDoc: RFSOC SAWG
size 420 x 297 mm; Author: G.Kasprowicz; CompanyName: WUT ISE; DrawnBy: G.Kasprowicz; Organization: WUT ISE; Address1: PW ISE; Address2: Nowowiejska 15/19 00-665 Warsaw; Address3: gkasprow@gmail.com; Revision: 1; SheetNumber: 3; SheetTotal: 4; ModifiedBy: -; CheckedDate: -; Title2: USB; DivGrp: WUT ISE; Designer: G.Kasprowicz; ModifiedDate: -; ProjectName: Sensor Box
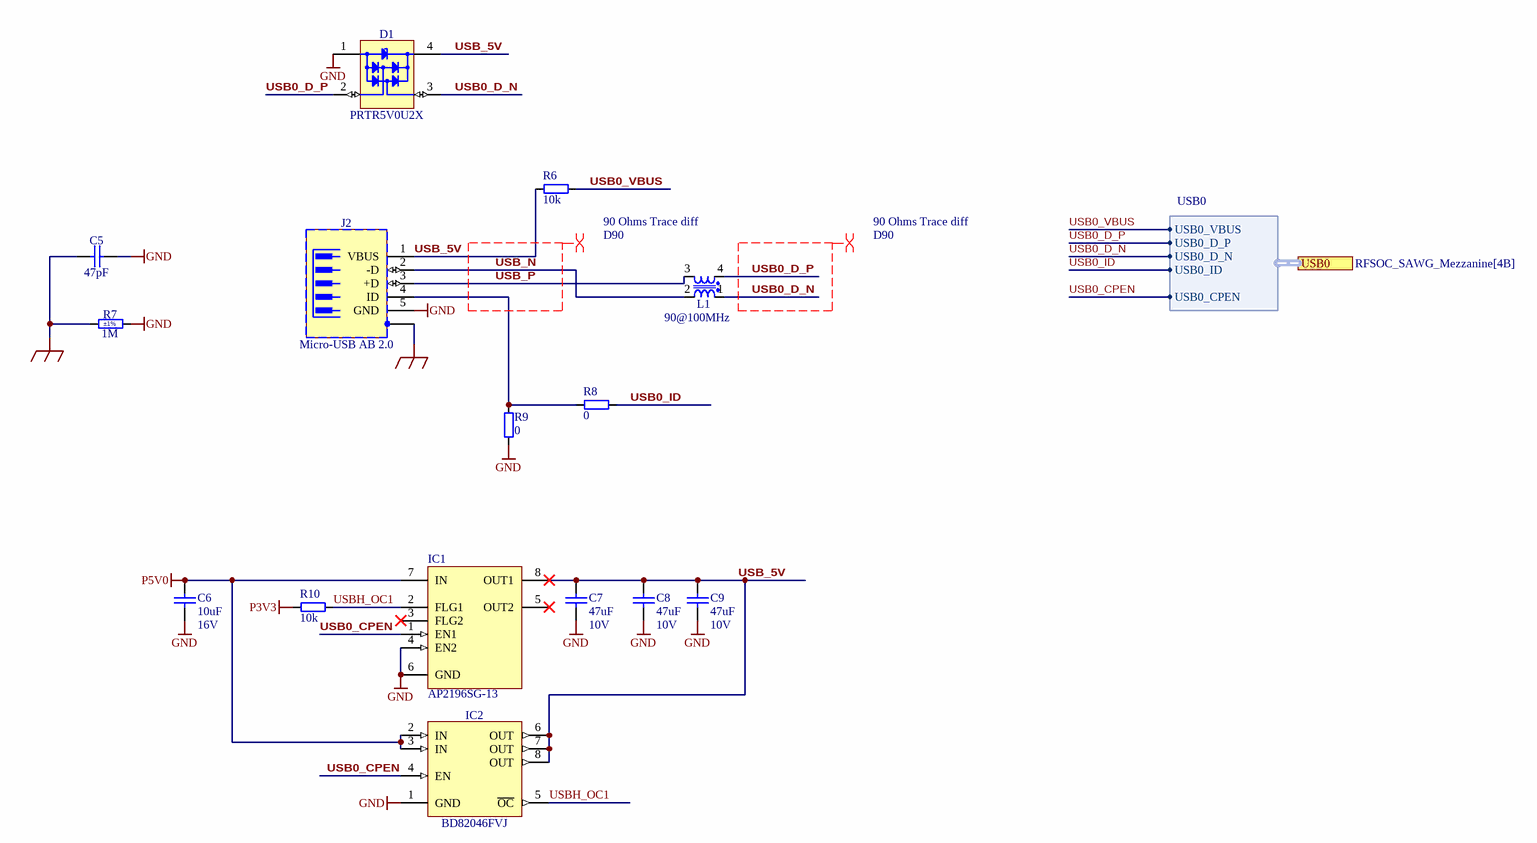
[diagram p3: MicroUSB.SchDoc]

### Parts
C5  47pF  [CAPC3216X140N]
C6  10uF  Voltage: 16V  [CAPC1608X80N]
C7  47uF  Voltage: 10V  [CAPC3216X180N]
C8  47uF  Voltage: 10V  [CAPC3216X180N]
C9  47uF  Voltage: 10V  [CAPC3216X180N]
D1  PRTR5V0U2X  [SOT190P230X110-4N]
IC1  AP2196SG-13  [SOIC127P600X175-8N]
IC2  BD82046FVJ  [SOP65P490X110-8N]
J2  Micro-USB AB 2.0  [HIROSE_ZX62RD-AB-5P8]
L1  90@100MHz  [IND_WURTH_WE-CNSW_0504]
R6  10k  [RESC1005X40N]
R7  1M  Tolerance: ±1%  [RESC3216X65N]
R8  0  [RESC1005X40N]
R9  0  [RESC1005X40N]
R10  10k  [RESC1005X40N]

### Ports
USB0 (harness USB0, see RFSOC_SAWG_Mezzanine[4B])

### Harnesses
USB0: USB0_VBUS, USB0_D_P, USB0_D_N, USB0_ID, USB0_CPEN

### Nets
FGND: C5.1 J2.6(SH) R7.1
GND: C5.2 C6.2 C7.2 C8.1 C9.1 D1.1(GND) IC1.4(EN2) IC1.6(GND) IC2.1(GND) J2.5(GND) R7.2 R9.1
P3V3: R10.1
P5V0: C6.1 IC1.7(IN) IC2.2(IN) IC2.3(IN)
USB0_CPEN: IC1.1(EN1) IC2.4(EN) ; port USB0.USB0_CPEN
USB0_D_N: D1.3(I/O2) L1.1 ; port USB0.USB0_D_N
USB0_D_P: D1.2(I/O1) L1.4 ; port USB0.USB0_D_P
USB0_ID: R8.2 ; port USB0.USB0_ID
USB0_VBUS: R6.2 ; port USB0.USB0_VBUS
USB_5V: C7.1 C8.2 C9.2 D1.4(VCC) IC1.8(OUT1) IC2.6(OUT) IC2.7(OUT) IC2.8(OUT) J2.1(VBUS) R6.1
USB_N: J2.2(-D) L1.2
USB_P: J2.3(+D) L1.3
USBH_OC1: IC1.2(FLG1) IC2.5(~{OC}) R10.2
NetJ2_4: J2.4(ID) R8.1 R9.2

Not connected (* = marked no-connect by the designer): IC1 3(FLG2)* 5(OUT2)*

### Layout directives
differential pair; differential pair class 90 Ohms Trace diff; net class D90: USB0_D_N, USB0_D_P, USB_N, USB_P

### Notes on the sheet
- Project/Equipment
- Document
- Designer
- Drawn by
- Check.by
- Copyright WUT ISE 2020.
  This documentation describes Open Hardware and is licensed under the CERN OHL v.1.2. You may redistribute and modify this documentation under the terms of the CERN OHL v.1.2. (http://ohwr.org/CERNOHL). This documentation is distributed WITHOUT ANY EXPRESS OR IMPLIED WARRANTY, INCLUDING OF MERCHANTABILITY, SATISFACTORY QUALITY AND FITNESS FOR A PARTICULAR PURPOSE. Please see the CERN OHL v.1.2 for applicable conditions.
- Contact
- File
- Last Mod.
- Print Date
- Sheet
- Size
- A3
- of
- Rev

### Library data of the parts
C5 = CC1206_47PF_1KV_10%_C0G: Non-polarised capacitor; Part Description: High Voltage MLC Chip Capacitor; Manufacturer: GENERIC; Manufacturer1 Part Number: 1206AA470KAT1A; Voltage: 1KV; TC: C0G/NP0; Tolerance: ±10%; Part Number: CC1206_47PF_1KV_10%_C0G; Component Kind: Standard; Component Type: Standard; Pin Count: 2; Value: 47pF; Status: None; Manufacturer Part Number: CC1206_47PF_1KV_10%_C0G; Case: 1206; Mounted: Yes; Socket: No; SMD: Yes; Sense: No; Manufacturer1 Example: AVX; Manufacturer1 ComponentHeight: 1.45mm; HelpURL: \\cern.ch\dfs\Applications\Altium\Datasheets\CC1206_C0G_AVX_HV-MLC.pdf; Author: CERN DEM BC; CreateDate: 14.12.2021; LatestRevisionDate: 14.12.2021
C6 = CC0603_10UF_16V_20%_X5R: Non-polarised capacitor; Part Description: SMD Multilayer Chip Ceramic Capacitor; Manufacturer: GENERIC; Manufacturer1 Part Number: GRM188R61C106MA73D; Tolerance: ±20%; TC: X5R; Case: 0603; Value: 10uF; Part Number: CC0603_10UF_16V_20%_X5R; Component Kind: Standard; Component Type: Standard; Pin Count: 2; Status: None; Manufacturer Part Number: CC0603_10UF_16V_20%_X5R; Mounted: Yes; Socket: No; SMD: Yes; Sense: No; Manufacturer1 Example: MURATA; Manufacturer1 ComponentHeight: 0.8mm; HelpURL: \\cern.ch\dfs\Applications\Altium\Datasheets\CC0603_X5R_MURATA_GRM.pdf; Author: CERN DEM MR; CreateDate: 02.03.2016; LatestRevisionDate: 02.03.2016
C7-C9 = CC1206_47UF_10V_10%_X5R: Non-polarised capacitor; Part Description: SMD Multilayer Chip Ceramic Capacitor; Manufacturer: GENERIC; Manufacturer1 Part Number: GRM31CR61A476KE15; Tolerance: ±10%; TC: X5R; Case: 1206; Value: 47uF; Part Number: CC1206_47UF_10V_10%_X5R; Component Kind: Standard; Component Type: Standard; Pin Count: 2; Status: None; Manufacturer Part Number: CC1206_47UF_10V_10%_X5R; Mounted: Yes; Socket: No; SMD: Yes; Sense: No; Manufacturer1 Example: MURATA; Manufacturer1 ComponentHeight: 1.8mm; HelpURL: \\cern.ch\dfs\Applications\Altium\Datasheets\CC1206_X5R_MURATA_GRM.pdf; Author: CERN DEM MR; CreateDate: 24.06.2016; LatestRevisionDate: 24.06.2016
D1 = PRTR5V0U2X: Ultra Low Capacitance Double Rail-to-Rail ESD Protection Diode; Part Description: Ultra Low Capacitance (1pF) Double Rail-to-Rail ESD Protection Diode (8kV); Manufacturer: NXP SEMICONDUCTORS; Voltage: 5.5V; PressFit: No; Bonding: No; Part Number: PRTR5V0U2X; Component Kind: Standard; Component Type: Standard; Device: PRTR5V0U2X; PackageDescription: SOT143B, SOT, 1.90mm Pitch; 4 Pin, 1.30mm W X 2.90mm L X 1.10mm H body, IPC Medium Density; Manufacturer Part Number: PRTR5V0U2X; Pin Count: 4; Case: SOT143B; Mounted: Yes; Socket: No; SMD: Yes; Sense: No; ComponentHeight: 1.1mm; HelpURL: \\cern.ch\dfs\Applications\Altium\Datasheets\PRTR5V0U2X.pdf; Author: CERN DEM JLC; CreateDate: 22.03.2011; LatestRevisionDate: 22.03.2011
IC1 = 27514: AN: 27514; Mixed: SMT; Extra: USB-Schalter-ICs 2x1.5A 2.7V-5.5V; Case: SO8; HelpURL: b:\AD\adlib\datasheet\AP21x6\; H-ART: AP2196SG-13
IC2 = BD82046FVJ: 3.2A Current Limit High Side Switch IC; Manufacturer: ROHM; PressFit: No; Bonding: No; Part Number: BD82046FVJ; Component Kind: Standard; Component Type: Standard; Device: BD82046FVJ; PackageDescription: SOP, 0.65mm Pitch; 8 Pin, 3.00mm W X 3.00mm L X 1.10mm H body, IPC Medium Density; Part Description: 3.2A Current Limit High Side Switch IC; Manufacturer Part Number: BD82046FVJ; Pin Count: 8; Case: TSSOP8; Mounted: Yes; Socket: No; SMD: Yes; Sense: No; ComponentHeight: 1.1mm; Author: CERN DEM BC; HelpURL: \\cern.ch\dfs\Applications\Altium\Datasheets\BD82046FVJ.pdf; CreateDate: 14.06.2021; LatestRevisionDate: 14.06.2021
J2 = HIROSE_ZX62RD-AB-5P8: 5 Pin + 1 Shield USB Receptacle; Part Description: Micro-USB 2.0 Right Angle, SMD Type AB - Reverse (Top mount), Shell Through Hole; Manufacturer: HIROSE (HRS); PressFit: No; Part Number: HIROSE_ZX62RD-AB-5P8; Component Kind: Standard; Component Type: Standard; Pin Count: 7; Family: Micro-USB AB 2.0; Mounted: Yes; Socket: No; SMD: Yes; Sense: No; Status: Obsolete; Manufacturer Part Number: ZX62RD-AB-5P8; ComponentHeight: 2.35mm; HelpURL: \\cern.ch\dfs\Applications\Altium\Datasheets\HIROSE_ZX62RD-AB-5P8.pdf; ComponentLink1URL: \\cern.ch\dfs\Applications\Altium\Datasheets\HIROSE_ZX62RD-AB-5P8_Package-Drawing.pdf; ComponentLink1Description: Package-Drawing; Author: CERN DEM JLC; CreateDate: 29.10.2014; LatestRevisionDate: 22.06.2017
L1 = IND0504_WURTH_7442335900: Inductor Common Mode; Part Description: Common Mode SMD Line Filter (WE-CNSW Series); Manufacturer: WURTH ELEKTRONIK; Power: 500mA; Resistance: 0.27R; Tolerance: ±25%; Part Number: IND0504_WURTH_7442335900; Component Kind: Standard; Component Type: Standard; Pin Count: 4; Value: 90@100MHz; Manufacturer Part Number: 7442335900; Case: 0504; Mounted: Yes; Socket: No; SMD: Yes; Sense: No; ComponentHeight: 1.1mm; HelpURL: \\cern.ch\dfs\Applications\Altium\Datasheets\IND0504_WURTH_7442335900.pdf; Author: CERN DEM JMW; CreateDate: 17.10.2019; LatestRevisionDate: 17.10.2019
R6 R10 = R0402_10K_1%_0.0625W_100PPM: as R11 on sheet Clock_fanout; Tolerance: ±1%; Case: 0402; Value: 10k; Part Number: R0402_10K_1%_0.0625W_100PPM; Component Kind: Standard; Component Type: Standard; Pin Count: 2; Status: Not Recommended; Power: 0.0625W; Manufacturer Part Number: R0402_10K_1%_0.0625W_100PPM; Mounted: Yes; Sense: No; Socket: No; SMD: Yes; Manufacturer1 Example: YAGEO PHYCOMP; Manufacturer1 ComponentHeight: 0.4mm; HelpURL: \\cern.ch\dfs\Applications\Altium\Datasheets\R0402_Phycomp_RC0402.pdf; Author: CERN DEM JLC; CreateDate: 03.12.2007; LatestRevisionDate: 17.10.2012
R7 = R1206_1M_1%_0.25W_100PPM: Resistor - 1%; Part Description: General Purpose Thick Film Chip Resistor; Manufacturer: GENERIC; Manufacturer1 Part Number: NRC12F1004TRF; Power: 0.25W; TC: ±100ppm/°C; PressFit: No; Part Number: R1206_1M_1%_0.25W_100PPM; Component Kind: Standard; Component Type: Standard; Pin Count: 2; Value: 1M; Status: Preferred; Manufacturer Part Number: R1206_1M_1%_0.25W_100PPM; Case: 1206; Mounted: Yes; Sense: No; Socket: No; SMD: Yes; Manufacturer1 Example: NIC COMPONENT; Manufacturer1 ComponentHeight: 0.65mm; HelpURL: \\cern.ch\dfs\Applications\Altium\Datasheets\R1206_NIC_NRC.pdf; Author: CERN DEM JLC; CreateDate: 03.12.2007; LatestRevisionDate: 13.03.2008
R8 R9 = R0402_0R_JUMPER: as R24 on sheet Clock_fanout; Case: 0402; Value: 0; Part Number: R0402_0R_JUMPER; Component Kind: Standard; Component Type: Standard; Pin Count: 2; Status: Not Recommended; Manufacturer Part Number: R0402_0R_JUMPER; Mounted: Yes; Sense: No; Socket: No; SMD: Yes; Manufacturer1 Example: YAGEO PHYCOMP; Manufacturer1 ComponentHeight: 0.4mm; HelpURL: \\cern.ch\dfs\Applications\Altium\Datasheets\R0402_Phycomp_RC0402.pdf; Author: CERN DEM JLC; CreateDate: 03.12.2007; LatestRevisionDate: 17.10.2012

## Nets that join several sheets
GND: RFSOC_SAWG_Mezzanine (12 pins), Clock_fanout (39 pins), ETH-PHY (7 pins), MicroUSB (12 pins)
P3V3: RFSOC_SAWG_Mezzanine (7 pins), Clock_fanout (L2.2), ETH-PHY (J1.14 J1.16), MicroUSB (R10.1)
P5V0: RFSOC_SAWG_Mezzanine (J16.32 J16.34 TP4.1), MicroUSB (C6.1 IC1.7 IC2.2 IC2.3)
NetJ15_1: RFSOC_SAWG_Mezzanine (J15.1), Clock_fanout (R24.1)
PHY_LED0: RFSOC_SAWG_Mezzanine (J16.25), ETH-PHY (R4.1)
PHY_LED1: RFSOC_SAWG_Mezzanine (J16.27), ETH-PHY (R5.1)
PHY_MDI0_N: RFSOC_SAWG_Mezzanine (J16.10), ETH-PHY (J1.10)
PHY_MDI0_P: RFSOC_SAWG_Mezzanine (J16.8), ETH-PHY (J1.11)
PHY_MDI1_N: RFSOC_SAWG_Mezzanine (J16.16), ETH-PHY (J1.5)
PHY_MDI1_P: RFSOC_SAWG_Mezzanine (J16.14), ETH-PHY (J1.4)
PHY_MDI2_N: RFSOC_SAWG_Mezzanine (J16.22), ETH-PHY (J1.2)
PHY_MDI2_P: RFSOC_SAWG_Mezzanine (J16.20), ETH-PHY (J1.3)
PHY_MDI3_N: RFSOC_SAWG_Mezzanine (J16.28), ETH-PHY (J1.9)
PHY_MDI3_P: RFSOC_SAWG_Mezzanine (J16.26), ETH-PHY (J1.8)
USB0_CPEN: RFSOC_SAWG_Mezzanine (J16.23), MicroUSB (IC1.1 IC2.4)
USB0_D_N: RFSOC_SAWG_Mezzanine (J16.17), MicroUSB (D1.3 L1.1)
USB0_D_P: RFSOC_SAWG_Mezzanine (J16.15), MicroUSB (D1.2 L1.4)
USB0_ID: RFSOC_SAWG_Mezzanine (J16.21), MicroUSB (R8.2)
USB0_VBUS: RFSOC_SAWG_Mezzanine (J16.11), MicroUSB (R6.2)

## Assembly variants
Default: not fitted C2 C4 IC1